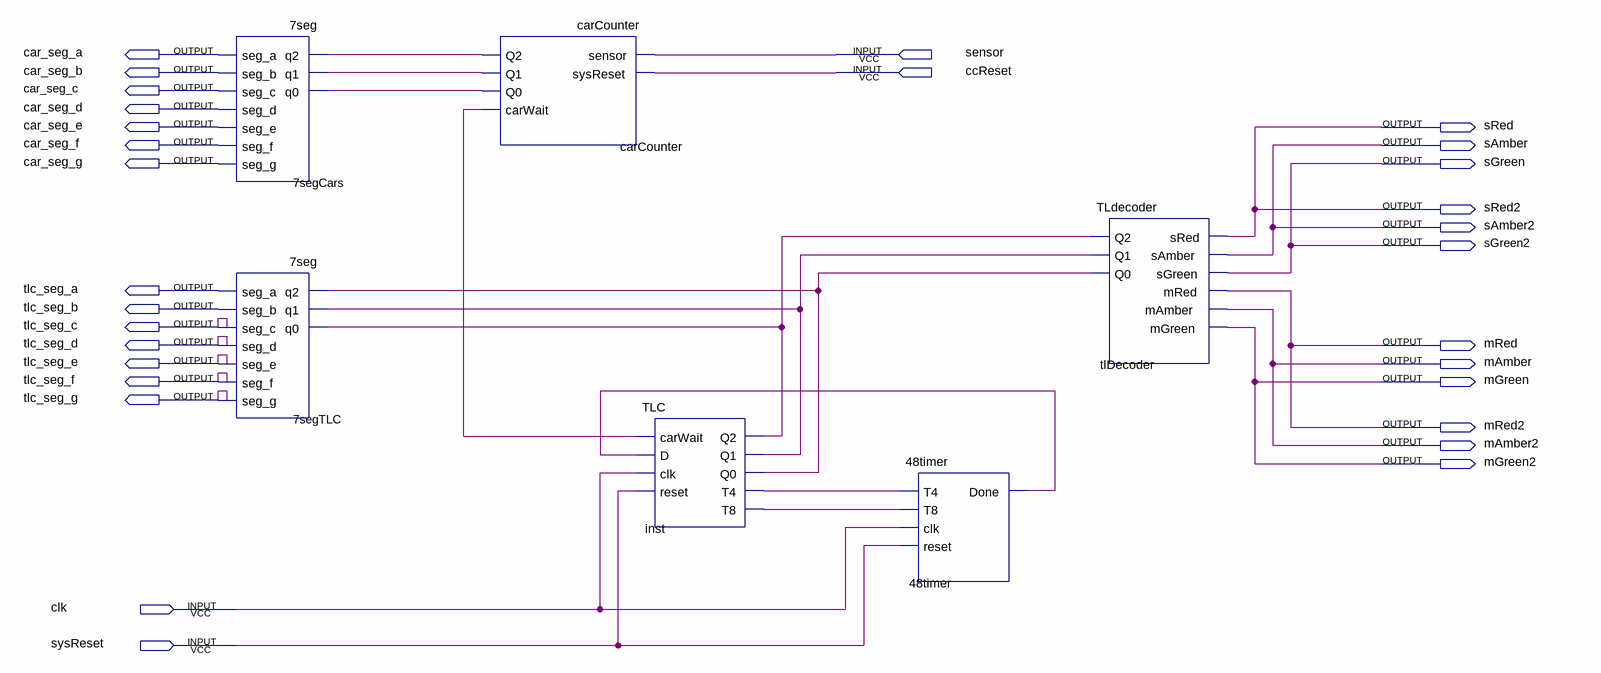
[diagram p0: schematic sheet]
// Quartus schematic Combined.bdf as structural Verilog: 6 symbols, 30 pins
module Combined (
  input  sensor,
  input  ccReset,
  input  clk,
  input  sysReset,
  output car_seg_a,
  output car_seg_b,
  output car_seg_c,
  output car_seg_d,
  output car_seg_e,
  output sRed,
  output car_seg_f,
  output sAmber,
  output car_seg_g,
  output sGreen,
  output sRed2,
  output sAmber2,
  output sGreen2,
  output tlc_seg_a,
  output tlc_seg_b,
  output tlc_seg_c,
  output tlc_seg_d,
  output mRed,
  output tlc_seg_e,
  output mAmber,
  output tlc_seg_f,
  output mGreen,
  output tlc_seg_g,
  output mRed2,
  output mAmber2,
  output mGreen2
);

  wire carCounter_carwait, carCounter_q0, carCounter_q1, carCounter_q2, inst_q0, inst_q1, inst_q2, inst_t4,
       inst_t8, n48timer_done;

  \7seg  u_7segCars (
    .q2(carCounter_q2), .q1(carCounter_q1), .q0(carCounter_q0), .seg_a(car_seg_a), .seg_b(car_seg_b),
    .seg_c(car_seg_c), .seg_d(car_seg_d), .seg_e(car_seg_e), .seg_f(car_seg_f), .seg_g(car_seg_g));
  \7seg  u_7segTLC (
    .q2(inst_q0), .q1(inst_q1), .q0(inst_q2), .seg_a(tlc_seg_a), .seg_b(tlc_seg_b), .seg_c(tlc_seg_c),
    .seg_d(tlc_seg_d), .seg_e(tlc_seg_e), .seg_f(tlc_seg_f), .seg_g(tlc_seg_g));
  carCounter carCounter (
    .sensor(sensor), .sysReset(ccReset), .Q2(carCounter_q2), .Q1(carCounter_q1), .Q0(carCounter_q0),
    .carWait(carCounter_carwait));
  TLC inst (
    .carWait(carCounter_carwait), .D(n48timer_done), .clk(clk), .reset(sysReset), .Q2(inst_q2), .Q1(inst_q1),
    .Q0(inst_q0), .T4(inst_t4), .T8(inst_t8));
  \48timer  u_48timer (.T4(inst_t4), .T8(inst_t8), .clk(clk), .reset(sysReset), .Done(n48timer_done));
  TLdecoder tlDecoder (
    .Q2(inst_q2), .Q1(inst_q1), .Q0(inst_q0), .sRed(sRed), .sAmber(sAmber), .sGreen(sGreen), .mRed(mRed),
    .mAmber(mAmber), .mGreen(mGreen));

  assign mAmber2 = mAmber;
  assign mGreen2 = mGreen;
  assign mRed2 = mRed;
  assign sAmber2 = sAmber;
  assign sGreen2 = sGreen;
  assign sRed2 = sRed;
endmodule
